# Altium schematic sheet test.SchDoc
size A
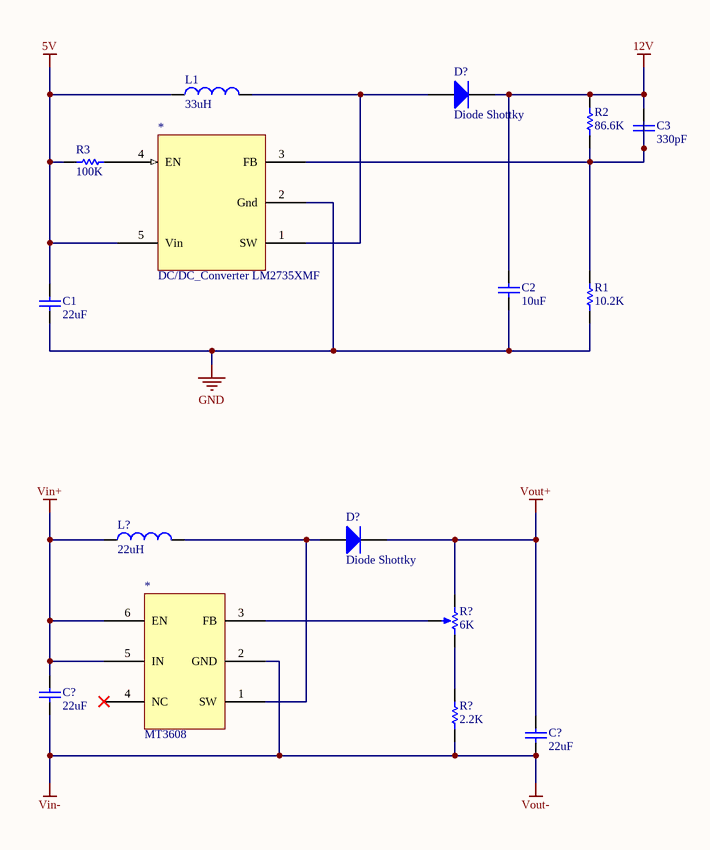
[diagram p0: test.SchDoc]

## Parts
(Parts that share a designator on the sheet are numbered #1, #2 ... from top to bottom, then left to right.)
*#1  DC/DC_Converter LM2735XMF
*#2  MT3608
C1  22uF  [RAD-0.3]
C2  10uF  [RAD-0.3]
C3  330pF  [RAD-0.3]
C?#1  22uF  [RAD-0.3]
C?#2  22uF  [RAD-0.3]
D?#1  Diode Shottky  [SMC]
D?#2  Diode Shottky  [SMC]
L1  33uH  [0402-A]
L?  22uH  [0402-A]
R1  10.2K  [AXIAL-0.3]
R2  86.6K  [AXIAL-0.3]
R3  100K  [AXIAL-0.3]
R?#1  6K  [VR5]
R?#2  2.2K  [AXIAL-0.3]

## Nets
5V: *#1.5(Vin) C1.2 L1.1 R3.1
12V: C2.2 C3.2 D?#1.2(K) R2.2
GND: *#1.2(Gnd) C1.1 C2.1 R1.1
Vin+: *#2.5(IN) *#2.6(EN) C?#1.2 L?.1
Vin-: *#2.2(GND) C?#1.1 C?#2.1 R?#2.1  [also labelled Vout-]
Vout+: C?#2.2 D?#2.2(K) R?#1.1(TOP)
Net*#1_1: *#1.1(SW) D?#1.1(A) L1.2
Net*#1_3: *#1.3(FB) C3.1 R1.2 R2.1
Net*#1_4: *#1.4(EN) R3.2
Net*#2_1: *#2.1(SW) D?#2.1(A) L?.2
Net*#2_3: *#2.3(FB) R?#1.3(TAP)
NetR?#1_2: R?#1.2(BOT) R?#2.2

Not connected (* = marked no-connect by the designer): *#2 4(NC)*

## Library data of the parts
C1-C3 = Cap: Capacitor; Published: 8-Jun-2000; LatestRevisionDate: 17-Jul-2002; LatestRevisionNote: Re-released for DXP Platform.; PackageReference: RAD-0.3; Publisher: Altium Limited; PackageDescription: Radial Cap, Thru-Hole; 2 Leads; 0.3 in Pin Spacing
  C1: Value: 22uF
  C2: Value: 10uF
  C3: Value: 330pF
C?#1 C?#2 = Cap: Capacitor; Value: 10uF; Published: 8-Jun-2000; LatestRevisionDate: 17-Jul-2002; LatestRevisionNote: Re-released for DXP Platform.; PackageReference: RAD-0.3; Publisher: Altium Limited; PackageDescription: Radial Cap, Thru-Hole; 2 Leads; 0.3 in Pin Spacing
D?#1 D?#2 = Diode: Default Diode; Published: 8-Jun-2000; LatestRevisionDate: 17-Jul-2002; LatestRevisionNote: Re-released for DXP Platform.; PackageVersion: Sep-1996; PackageReference: SMC; Publisher: Altium Limited; PackageDescription: DO-214-AB/SMC; 2 C-Bend Leads; Body 7.9 x 5.9 mm, inc. leads (LxW); Code_JEDEC: DO-214-AB
L1 = Inductor: Code_IEC: 1005; Published: 8-Jun-2000; LatestRevisionDate: 29-May-2009; LatestRevisionNote: IPC-7351 Footprint Added.; PackageReference: 0402-A; Publisher: Altium Limited; PackageDescription: Chip Inductor; Code_JEITA: 0402; Value: 33uH
L? = Inductor: Code_IEC: 1005; Value: 33uH; Published: 8-Jun-2000; LatestRevisionDate: 29-May-2009; LatestRevisionNote: IPC-7351 Footprint Added.; PackageReference: 0402-A; Publisher: Altium Limited; PackageDescription: Chip Inductor; Code_JEITA: 0402
R1-R3 = Res1: Resistor; Published: 8-Jun-2000; LatestRevisionDate: 17-Jul-2002; LatestRevisionNote: Re-released for DXP Platform.; PackageReference: AXIAL-0.3; Publisher: Altium Limited; PackageDescription: Axial Device, Thru-Hole; 2 Leads; 0.3 in Pin Spacing
  R1: Value: 10.2K
  R2: Value: 86.6K
  R3: Value: 100K
R?#1 = RPot: Potentiometer; Sim Note: Enter the Resistance value and the set point into parameter fields.; Set Position: 0.5; Value: 1K; Published: 8-Jun-2000; LatestRevisionDate: 17-Jul-2002; LatestRevisionNote: Re-released for DXP Platform.; PackageReference: VR5; Publisher: Altium Limited; PackageDescription: Variable Resistor, Thru-Hole; 3 Leads
R?#2 = Res1: Resistor; Value: 10.2K; Published: 8-Jun-2000; LatestRevisionDate: 17-Jul-2002; LatestRevisionNote: Re-released for DXP Platform.; PackageReference: AXIAL-0.3; Publisher: Altium Limited; PackageDescription: Axial Device, Thru-Hole; 2 Leads; 0.3 in Pin Spacing